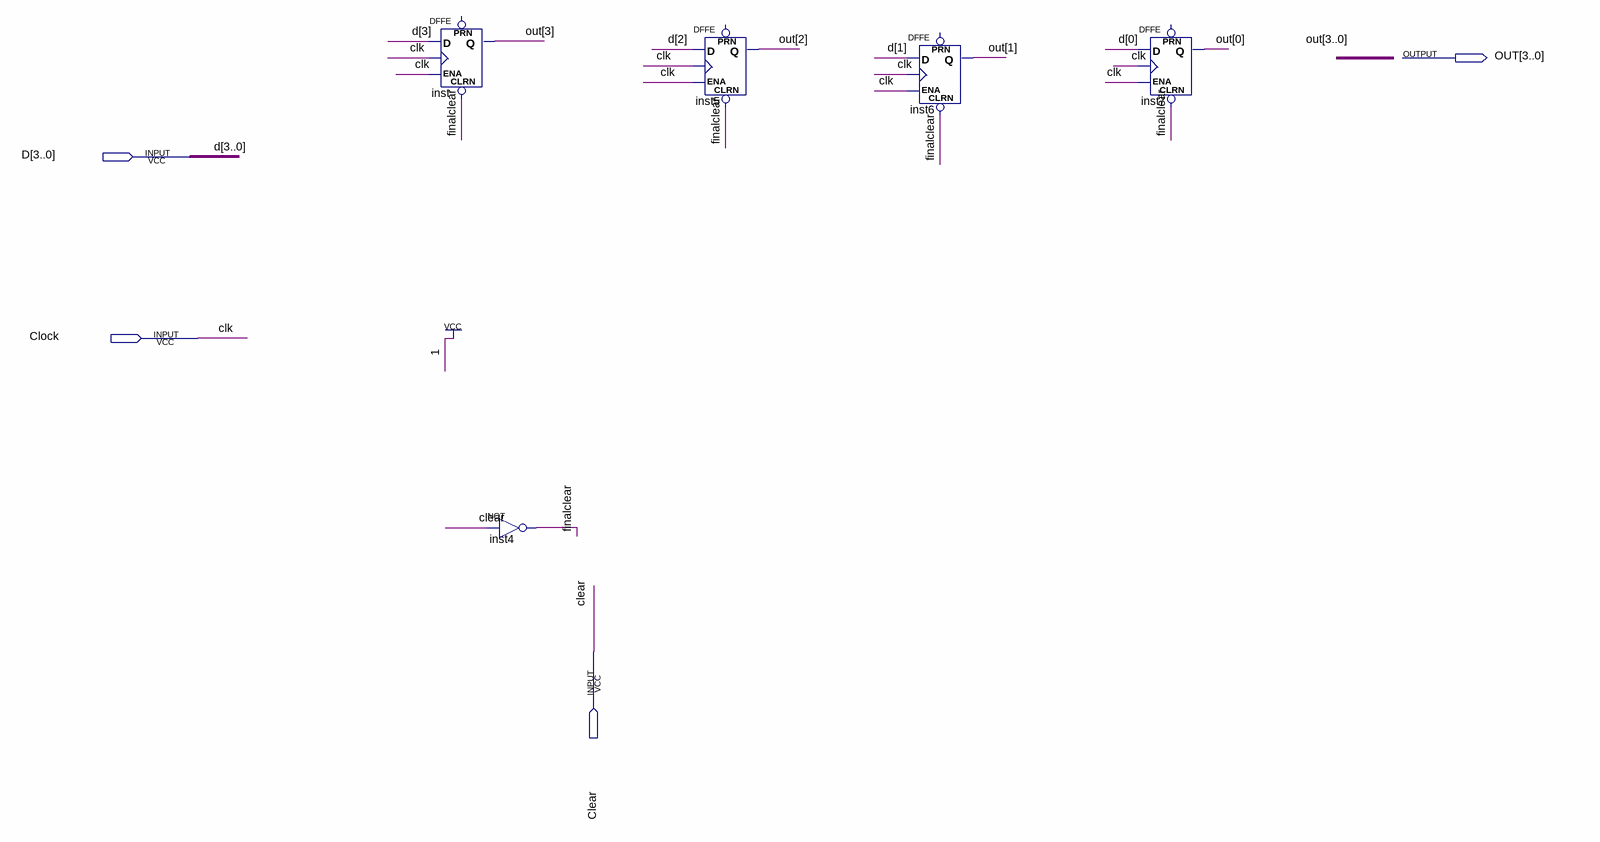
[diagram p0: schematic sheet]
// Quartus schematic shift_regitster_4bit.bdf as structural Verilog: 5 symbols, 4 pins
module shift_regitster_4bit (
  input  [3:0] D,
  input  Clock,
  input  Clear,
  output [3:0] OUT
);

  wire finalclear;

  DFFE inst (.CLRN(finalclear), .D(D[3]), .CLK(Clock), .ENA(Clock), .Q(OUT[3]));  // open: PRN
  not inst4 (finalclear, Clear);
  DFFE inst5 (.CLRN(finalclear), .D(D[2]), .CLK(Clock), .ENA(Clock), .Q(OUT[2]));  // open: PRN
  DFFE inst6 (.CLRN(finalclear), .D(D[1]), .CLK(Clock), .ENA(Clock), .Q(OUT[1]));  // open: PRN
  DFFE inst7 (.CLRN(finalclear), .D(D[0]), .CLK(Clock), .ENA(Clock), .Q(OUT[0]));  // open: PRN

  // Other names for the same wires on the sheet: clk = Clock
endmodule
